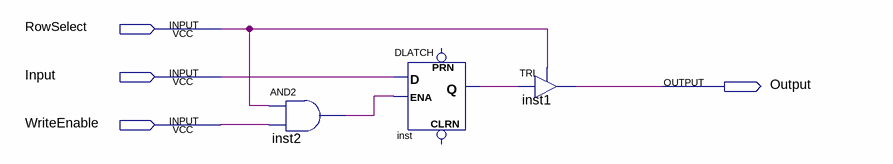
[diagram p0: schematic sheet]
// Quartus schematic mc.bdf as structural Verilog: 3 symbols, 4 pins
module mc (
  input  RowSelect,
  input  Input,
  input  WriteEnable,
  output Output
);

  wire inst2_out, inst_q;

  and inst2 (inst2_out, RowSelect, WriteEnable);
  DLATCH inst (.D(Input), .ENA(inst2_out), .Q(inst_q));  // open: CLRN, PRN
  TRI inst1 (.IN(inst_q), .OE(RowSelect), .OUT(Output));
endmodule
